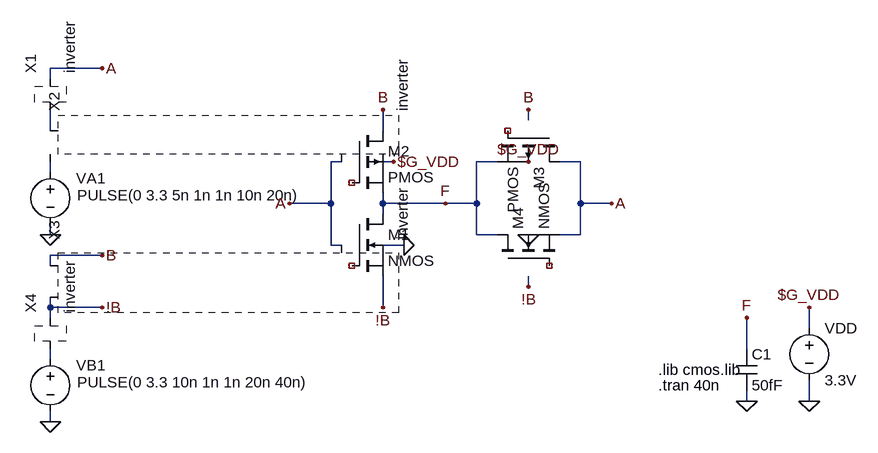
[diagram p0: schematic tg_xor.asc]
tg_xor.asc, the LTspice schematic file:
Version 4
SHEET 1 1292 680
WIRE -2128 -544 -2208 -544
WIRE -2208 -528 -2208 -544
WIRE -1472 -464 -1472 -480
WIRE -2208 -448 -2208 -480
WIRE -1696 -448 -1696 -480
WIRE -1760 -400 -1776 -400
WIRE -1680 -400 -1696 -400
WIRE -1520 -400 -1552 -400
WIRE -1392 -400 -1424 -400
WIRE -2208 -384 -2208 -400
WIRE -1776 -336 -1776 -400
WIRE -1776 -336 -1840 -336
WIRE -1696 -336 -1696 -352
WIRE -1600 -336 -1696 -336
WIRE -1552 -336 -1552 -400
WIRE -1552 -336 -1600 -336
WIRE -1392 -336 -1392 -400
WIRE -1344 -336 -1392 -336
WIRE -1696 -320 -1696 -336
WIRE -2208 -288 -2208 -304
WIRE -1552 -288 -1552 -336
WIRE -1520 -288 -1552 -288
WIRE -1392 -288 -1392 -336
WIRE -1392 -288 -1424 -288
WIRE -1776 -272 -1776 -336
WIRE -1760 -272 -1776 -272
WIRE -1664 -272 -1696 -272
WIRE -2128 -256 -2208 -256
WIRE -2208 -240 -2208 -256
WIRE -1472 -208 -1472 -224
WIRE -2208 -176 -2208 -192
WIRE -2128 -176 -2208 -176
WIRE -1696 -176 -1696 -224
WIRE -2208 -160 -2208 -176
WIRE -1040 -144 -1040 -176
WIRE -1136 -112 -1136 -160
WIRE -2208 -96 -2208 -112
WIRE -1136 -32 -1136 -48
WIRE -1040 -32 -1040 -64
WIRE -2208 0 -2208 -16
FLAG -1136 -32 0
FLAG -1600 -336 F
FLAG -1040 -176 $G_VDD
FLAG -1040 -32 0
FLAG -1136 -160 F
FLAG -1664 -272 0
FLAG -1680 -400 $G_VDD
FLAG -1344 -336 A
FLAG -1840 -336 A
FLAG -1696 -480 B
FLAG -1696 -176 !B
FLAG -2208 -288 0
FLAG -2128 -544 A
FLAG -2208 0 0
FLAG -2128 -256 B
FLAG -1472 -208 !B
FLAG -1472 -480 B
FLAG -1472 -400 $G_VDD
FLAG -1472 -288 0
FLAG -2128 -176 !B
SYMBOL cap -1152 -112 R0
SYMATTR InstName C1
SYMATTR Value 50fF
SYMBOL voltage -1040 -160 R0
WINDOW 123 0 0 Left 2
WINDOW 39 0 0 Left 2
SYMATTR InstName VDD
SYMATTR Value 3.3V
SYMBOL nmos -1744 -320 R0
SYMATTR InstName M1
SYMATTR Value2 l=0.6u w=1.5u
SYMATTR Value NMOS
SYMBOL pmos -1744 -448 R0
SYMATTR InstName M2
SYMATTR Value2 l=0.6u w=3u
SYMATTR SpiceModel ""
SYMATTR Value PMOS
SYMBOL voltage -2208 -400 R0
WINDOW 123 0 0 Left 2
WINDOW 39 0 0 Left 2
WINDOW 3 41 51 Left 2
WINDOW 0 40 25 Left 2
SYMATTR Value PULSE(0 3.3 5n 1n 1n 10n 20n)
SYMATTR InstName VA1
SYMBOL inverter -2208 -496 R270
SYMATTR InstName X1
SYMBOL inverter -2208 -416 R270
SYMATTR InstName X2
SYMBOL voltage -2208 -112 R0
WINDOW 123 0 0 Left 2
WINDOW 39 0 0 Left 2
WINDOW 3 41 51 Left 2
WINDOW 0 40 25 Left 2
SYMATTR Value PULSE(0 3.3 10n 1n 1n 20n 40n)
SYMATTR InstName VB1
SYMBOL inverter -2208 -208 R270
SYMATTR InstName X3
SYMBOL inverter -2208 -128 R270
SYMATTR InstName X4
SYMBOL nmos -1520 -240 R270
SYMATTR InstName M4
SYMATTR Value2 l=0.6u w=1.5u
SYMATTR Value NMOS
SYMBOL pmos -1424 -448 R90
SYMATTR InstName M3
SYMATTR Value2 l=0.6u w=3u
SYMATTR SpiceModel ""
SYMATTR Value PMOS
TEXT -1272 -56 Left 2 !.tran 40n
TEXT -1272 -80 Left 2 !.lib cmos.lib

The netlist it stands for:
* tg_xor.asc
C1 F 0 50fF
VDD $G_VDD 0 3.3V
M1 F NC_01 !B !B NMOS l=0.6u w=1.5u
M2 B NC_02 F F PMOS l=0.6u w=3u
VA1 N002 0 PULSE(0 3.3 5n 1n 1n 10n 20n)
* X1: inverter (symbol inverter not available, pin order unknown); nets seen at it: A, N001
* X2: inverter (symbol inverter not available, pin order unknown); nets seen at it: $G_VDD, A, N001, N002
VB1 N003 0 PULSE(0 3.3 10n 1n 1n 20n 40n)
* X3: inverter (symbol inverter not available, pin order unknown); nets seen at it: !B, 0, A, B
* X4: inverter (symbol inverter not available, pin order unknown); nets seen at it: !B, N003
* M4: NMOS l=0.6u w=1.5u (symbol nmos not certain, pin order unknown); nets seen at it: A, F
* M3: PMOS l=0.6u w=3u (symbol pmos not certain, pin order unknown); nets seen at it: A, F
.model NMOS NMOS
.model PMOS PMOS
.lib standard.mos
.tran 40n
.lib cmos.lib
.backanno
.end